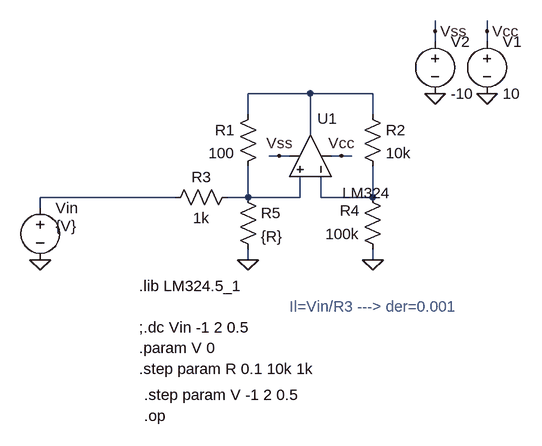
[diagram p0: schematic TPSRA1.2.asc]
TPSRA1.2.asc, the LTspice schematic file:
Version 4
SHEET 1 984 680
WIRE 448 -80 448 -96
WIRE 528 -80 528 -96
WIRE 448 -64 448 -80
WIRE 528 -64 528 -80
WIRE 256 16 160 16
WIRE 352 16 256 16
WIRE 160 48 160 16
WIRE 352 48 352 16
WIRE 256 80 256 16
WIRE 208 112 192 112
WIRE 224 112 208 112
WIRE 304 112 288 112
WIRE 320 112 304 112
WIRE 48 176 -160 176
WIRE 160 176 160 128
WIRE 160 176 128 176
WIRE 240 176 240 144
WIRE 240 176 160 176
WIRE 272 176 272 144
WIRE 352 176 352 128
WIRE 352 176 272 176
WIRE -160 192 -160 176
WIRE 160 272 160 256
WIRE 352 272 352 256
FLAG 352 272 0
FLAG 160 272 0
FLAG 208 112 Vss
FLAG 304 112 Vcc
FLAG 448 16 0
FLAG 528 16 0
FLAG 448 -80 Vss
FLAG 528 -80 Vcc
FLAG -160 272 0
SYMBOL Opamps\\opamp2 320 112 M270
WINDOW 0 57 53 VLeft 2
WINDOW 3 -29 15 Invisible 2
WINDOW 38 -57 15 VLeft 2
SYMATTR InstName U1
SYMATTR Value ""
SYMATTR SpiceModel LM324
SYMBOL res 368 272 R180
WINDOW 0 36 76 Left 2
WINDOW 3 36 40 Left 2
SYMATTR InstName R4
SYMATTR Value 100k
SYMBOL res 336 32 R0
SYMATTR InstName R2
SYMATTR Value 10k
SYMBOL res 176 32 M0
SYMATTR InstName R1
SYMATTR Value 100
SYMBOL res 144 160 R90
WINDOW 0 0 56 VBottom 2
WINDOW 3 32 56 VTop 2
SYMATTR InstName R3
SYMATTR Value 1k
SYMBOL voltage 528 -80 R0
SYMATTR InstName V1
SYMATTR Value 10
SYMBOL voltage 448 -80 R0
SYMATTR InstName V2
SYMATTR Value -10
SYMBOL voltage -160 176 R0
WINDOW 3 24 44 Left 2
WINDOW 123 0 0 Left 2
WINDOW 39 0 0 Left 2
SYMATTR Value {V}
SYMATTR InstName Vin
SYMBOL res 144 160 R0
SYMATTR InstName R5
SYMATTR Value {R}
TEXT -8 312 Left 2 !.lib LM324.5_1
TEXT -8 440 Left 2 !.step param R 0.1 10k 1k
TEXT -8 376 Left 2 !;.dc Vin -1 2 0.5
TEXT 0 512 Left 2 !.op
TEXT 0 480 Left 2 !.step param V -1 2 0.5
TEXT -8 408 Left 2 !.param V 0
TEXT 224 344 Left 2 ;Il=Vin/R3 ---> der=0.001

The netlist it stands for:
* TPSRA1.2.asc
XU1 N003 N004 Vcc Vss N001 LM324  ; pins In+ In- V+ V- OUT
R4 0 N004 100k
R2 N001 N004 10k
R1 N001 N003 100
R3 N003 N002 1k
V1 Vcc 0 10
V2 Vss 0 -10
Vin N002 0 {V}
R5 N003 0 {R}
.lib LM324.5_1
.step param R 0.1 10k 1k
;.dc Vin -1 2 0.5
.op
.step param V -1 2 0.5
.param V 0
* Il=Vin/R3 ---> der=0.001
.backanno
.end